# EAGLE design placa (EAGLE 9.6.2)
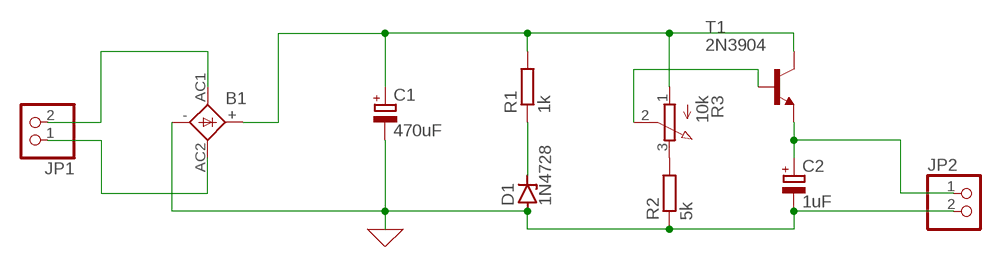
[diagram p0: schematic, sheet 1]

## Parts
B1  1KAB  [1KAB]
C1  470uF  CPOL-EUE5-10.5  [E5-10,5]
C2  1uF  CPOL-EUE5-10.5  [E5-10,5]
D1  1N4728  [DO41Z10]
JP1  PINHD-1X2  [1X02]
JP2  PINHD-1X2  [1X02]
R1  1k  R-EU_0204/7  [0204/7]
R2  5k  R-EU_0204/7  [0204/7]
R3  10k  3RP/1610N  [3RP/1610N]
T1  2N3904  [TO92]

## Nets
0: B1.- C1.- C2.- D1.A JP2.2 R2.1 ; supply symbol labelled GND
N$1: B1.AC1 JP1.2
N$2: B1.AC2 JP1.1
N$3: B1.+ C1.+ R1.2 R3.1(A) T1.1(C)
N$4: R2.2 R3.3(E)
N$5: C2.+ JP2.1 T1.3(E)
N$6: D1.C R1.1
N$8: R3.2(S) T1.2(B)

## Library data of the parts
B1 = rectifier:1KAB: RECTIFIER grid 5,08 x 5,08 mm
C1 C2 = rcl:CPOL-EU: POLARIZED CAPACITOR, European symbol; SPICEPREFIX: C
D1 = diode:1N4728: Z DIODE 3.3 V, 1W, 5 percent
JP1 JP2 = pinhead:PINHD-1X2: PIN HEADER
R1 R2 = rcl:R-EU_: RESISTOR, European symbol; SPICEPREFIX: R
R3 = pot:3RP/1610N: 16mm Potentiometer one level Source: http://www.alphapotentiometers.net/html/16mm_pot_2.html
T1 = transistor:2N3904: NPN TRANSISTOR

## Board
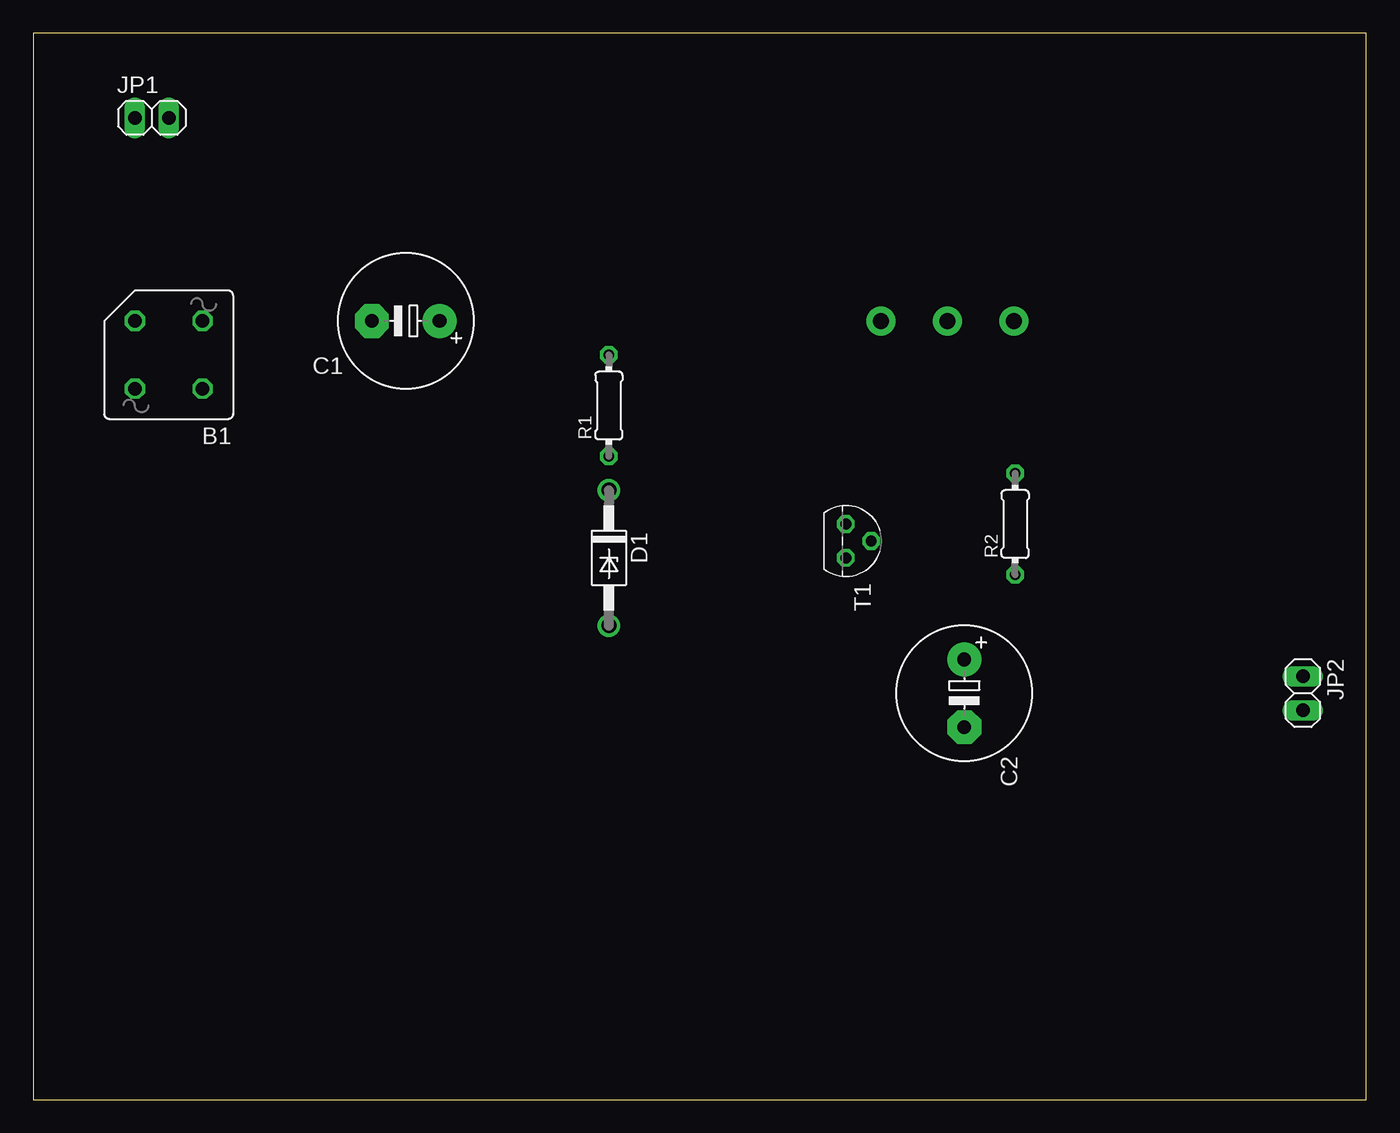
[diagram p1: board, top side]
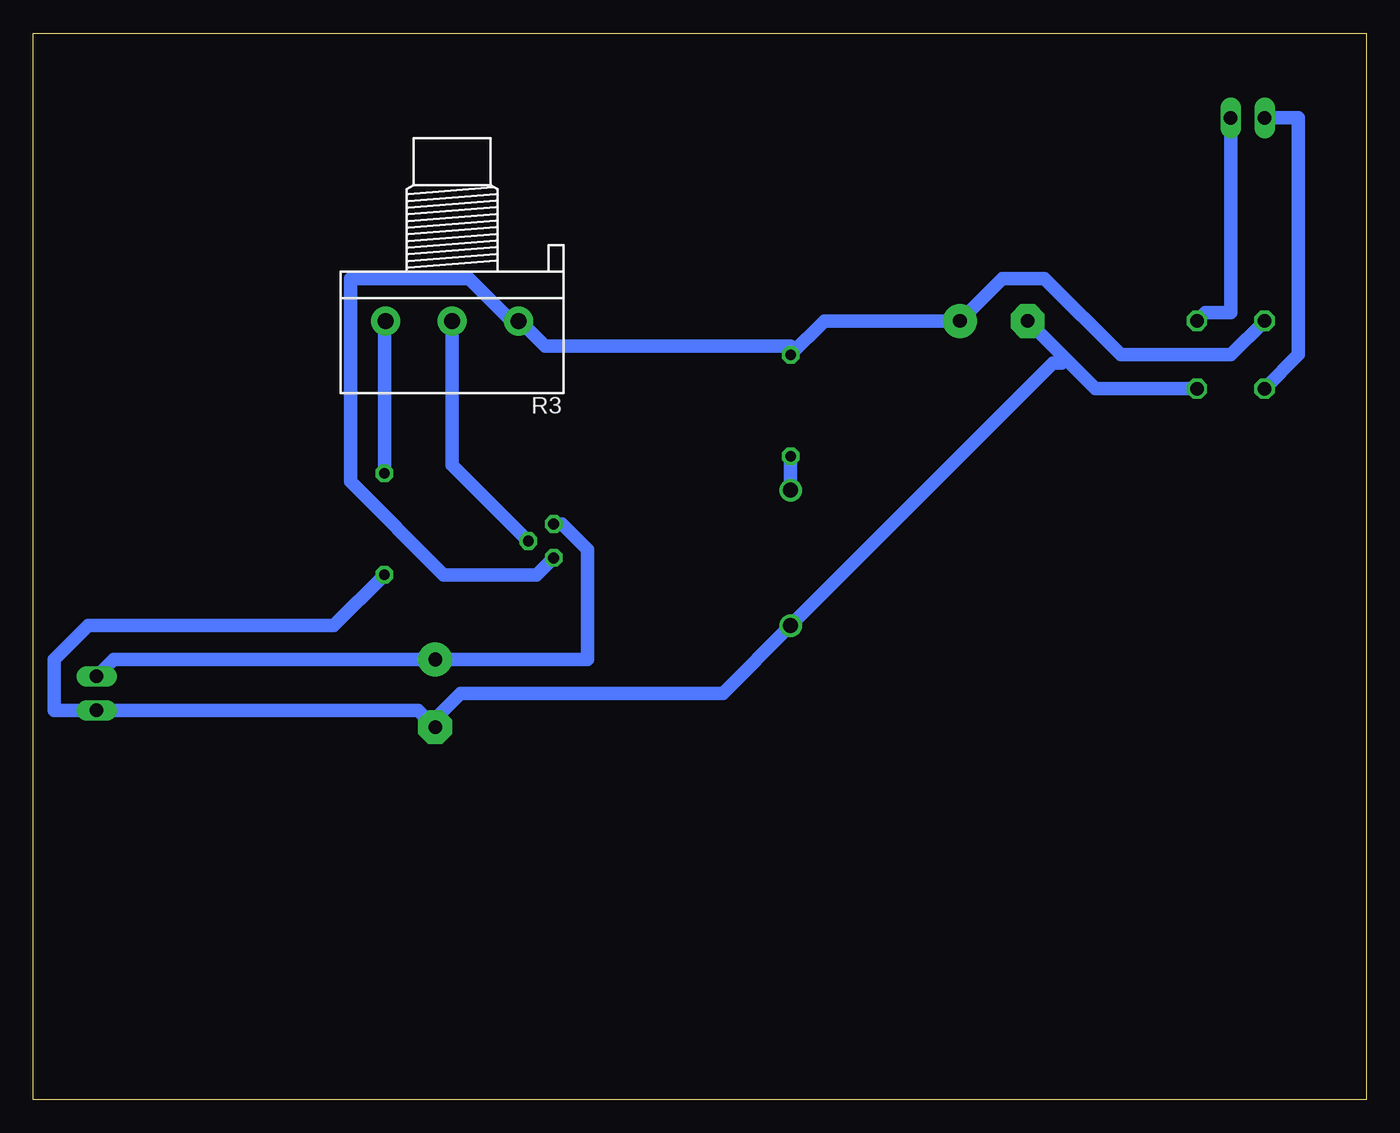
[diagram p2: board, bottom side, seen from below]

Size 100 x 80 mm. Coordinates in mm from the lower left corner, seen from the top.
Outline: 0,0 100,0 100,80 0,80 0,0
Copper layers (1*16): Top 0.035mm / dielectric 1.5mm / Bottom 0.035mm
Design rules "default *": minimum track width 40mil, minimum drill 0.35mm, track to track 40mil, track to pad 40mil, pad to pad 40mil, via to via 40mil, smd to smd 6mil, copper to edge 40mil, drill to drill 6mil, minimum pad ring 10mil, minimum via ring 8mil, stop-mask expansion 4mil, vias tented up to drill 0mil, thermal gap 10mil

### Footprints (pad centres in the part's own frame; a part is rotated, then mirrored left to right if it is on the bottom)
1KAB = drill 1.016 octagon: + 2.54,-2.54; - -2.54,2.54; AC1 -2.54,-2.54; AC2 2.54,2.54
E5-10,5 = drill 1.016 pad 2.54: + -2.54,0 | drill 1.016 pad 2.54 octagon: - 2.54,0
DO41Z10 = drill 1.118: A 5.08,0; C -5.08,0
1X02 = drill 1.016 long: 1 -1.27,0; 2 1.27,0
0204/7 = drill 0.813 octagon: 1 -3.81,0; 2 3.81,0
3RP/1610N = drill 1.2 pad 2.184: 1 -5,0; 2 0,0; 3 5,0
TO92 = drill 0.813 octagon: 1 1.27,0; 2 0,1.905; 3 -1.27,0

### Placement (x,y rotation side)
B1  10.16,55.88 180 top
C1  27.94,58.42 180 top
C2  69.85,30.48 270 top
D1  43.18,40.64 270 top
JP1  8.89,73.66 0 top
JP2  95.25,30.48 270 top
R1  43.18,52.07 90 top
R2  73.66,43.18 90 top
R3  68.58,58.42 180 bottom
T1  60.96,41.91 270 top

### Tracks (layer width: path | path; a pad name or v marks a point on that pad's centre or on a via)
0
  Bottom 1.016: R2.1 77.47,35.56 95.89,35.56 98.42,33.02 98.42,29.21 JP2.2 71.12,29.21 C2.- 69.85,28.57 67.94,30.48 48.26,30.48 D1.A 23.5,55.24 22.86,55.24 22.54,55.56 | B1.- 20.32,53.34 22.54,55.56 | C1.- 22.54,55.56
N$1
  Bottom 1.016: JP1.2 10.16,59.05 12.06,59.05 B1.AC1
N$2
  Bottom 1.016: B1.AC2 5.08,55.88 5.08,73.66 JP1.1
N$3
  Bottom 1.016: T1.1 62.23,39.37 69.22,39.37 76.2,46.35 76.2,61.59 67.31,61.59 64.14,58.42 R3.1 63.5,58.42 61.59,56.52 43.18,56.52 R1.2 40.64,58.42 C1.+ 27.3,61.59 24.13,61.59 18.41,55.88 10.16,55.88 B1.+
N$4
  Bottom 1.016: R2.2 73.66,58.42 R3.3
N$5
  Bottom 1.016: T1.3 60.33,43.18 58.42,41.27 58.42,33.02 C2.+ 93.98,33.02 JP2.1
N$6
  Bottom 1.016: D1.C R1.1
N$8
  Bottom 1.016: T1.2 68.58,47.62 R3.2